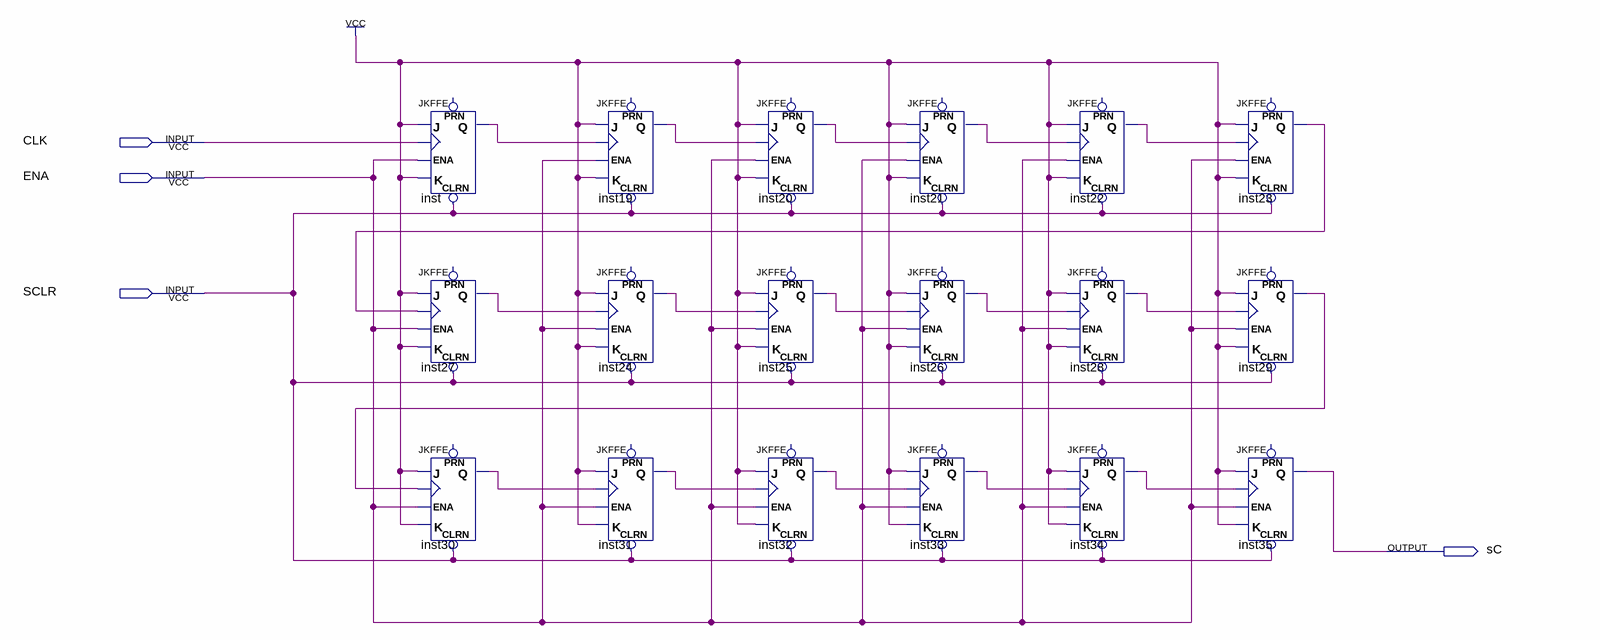
[diagram p0: schematic sheet]
// Quartus schematic contador_para_deboucing.bdf as structural Verilog: 18 symbols, 4 pins
module contador_para_deboucing (
  input  CLK,
  input  ENA,
  input  SCLR,
  output sC
);

  wire inst19_q, inst20_q, inst21_q, inst22_q, inst23_q, inst24_q, inst25_q, inst26_q, inst27_q, inst28_q,
       inst29_q, inst30_q, inst31_q, inst32_q, inst33_q, inst34_q, inst_q;

  JKFFE inst (.J(1'b1), .CLK(CLK), .CLRN(SCLR), .K(1'b1), .ENA(ENA), .Q(inst_q));  // open: PRN
  JKFFE inst27 (.J(1'b1), .CLK(inst23_q), .CLRN(SCLR), .K(1'b1), .ENA(ENA), .Q(inst27_q));  // open: PRN
  JKFFE inst30 (.J(1'b1), .CLK(inst29_q), .CLRN(SCLR), .K(1'b1), .ENA(ENA), .Q(inst30_q));  // open: PRN
  JKFFE inst19 (.J(1'b1), .CLK(inst_q), .CLRN(SCLR), .K(1'b1), .ENA(ENA), .Q(inst19_q));  // open: PRN
  JKFFE inst24 (.J(1'b1), .CLK(inst27_q), .CLRN(SCLR), .K(1'b1), .ENA(ENA), .Q(inst24_q));  // open: PRN
  JKFFE inst31 (.J(1'b1), .CLK(inst30_q), .CLRN(SCLR), .K(1'b1), .ENA(ENA), .Q(inst31_q));  // open: PRN
  JKFFE inst20 (.J(1'b1), .CLK(inst19_q), .CLRN(SCLR), .K(1'b1), .ENA(ENA), .Q(inst20_q));  // open: PRN
  JKFFE inst25 (.J(1'b1), .CLK(inst24_q), .CLRN(SCLR), .K(1'b1), .ENA(ENA), .Q(inst25_q));  // open: PRN
  JKFFE inst32 (.J(1'b1), .CLK(inst31_q), .CLRN(SCLR), .K(1'b1), .ENA(ENA), .Q(inst32_q));  // open: PRN
  JKFFE inst21 (.J(1'b1), .CLK(inst20_q), .CLRN(SCLR), .K(1'b1), .ENA(ENA), .Q(inst21_q));  // open: PRN
  JKFFE inst26 (.J(1'b1), .CLK(inst25_q), .CLRN(SCLR), .K(1'b1), .ENA(ENA), .Q(inst26_q));  // open: PRN
  JKFFE inst33 (.J(1'b1), .CLK(inst32_q), .CLRN(SCLR), .K(1'b1), .ENA(ENA), .Q(inst33_q));  // open: PRN
  JKFFE inst22 (.J(1'b1), .CLK(inst21_q), .CLRN(SCLR), .K(1'b1), .ENA(ENA), .Q(inst22_q));  // open: PRN
  JKFFE inst28 (.J(1'b1), .CLK(inst26_q), .CLRN(SCLR), .K(1'b1), .ENA(ENA), .Q(inst28_q));  // open: PRN
  JKFFE inst34 (.J(1'b1), .CLK(inst33_q), .CLRN(SCLR), .K(1'b1), .ENA(ENA), .Q(inst34_q));  // open: PRN
  JKFFE inst23 (.J(1'b1), .CLK(inst22_q), .CLRN(SCLR), .K(1'b1), .ENA(ENA), .Q(inst23_q));  // open: PRN
  JKFFE inst29 (.J(1'b1), .CLK(inst28_q), .CLRN(SCLR), .K(1'b1), .ENA(ENA), .Q(inst29_q));  // open: PRN
  JKFFE inst35 (.J(1'b1), .CLK(inst34_q), .CLRN(SCLR), .K(1'b1), .ENA(ENA), .Q(sC));  // open: PRN
endmodule
